# Altium schematic sheet 2_Cart_插槽板.schdoc.schdoc
size 309 x 223 mm; Symbol: Sheet-Symbol_A4; Device: Sheet-Symbol_A4; Company: 嘉立创EDA; Version: V1.0; Page Size: A4; @Project Name: 0117_230627_uMSX 4.0; @Page Count: 4; @Update Date: 2023-07-03; @Schematic Name: uMSX 4.0; @Page No: 2; @Page Name: Cart/插槽板
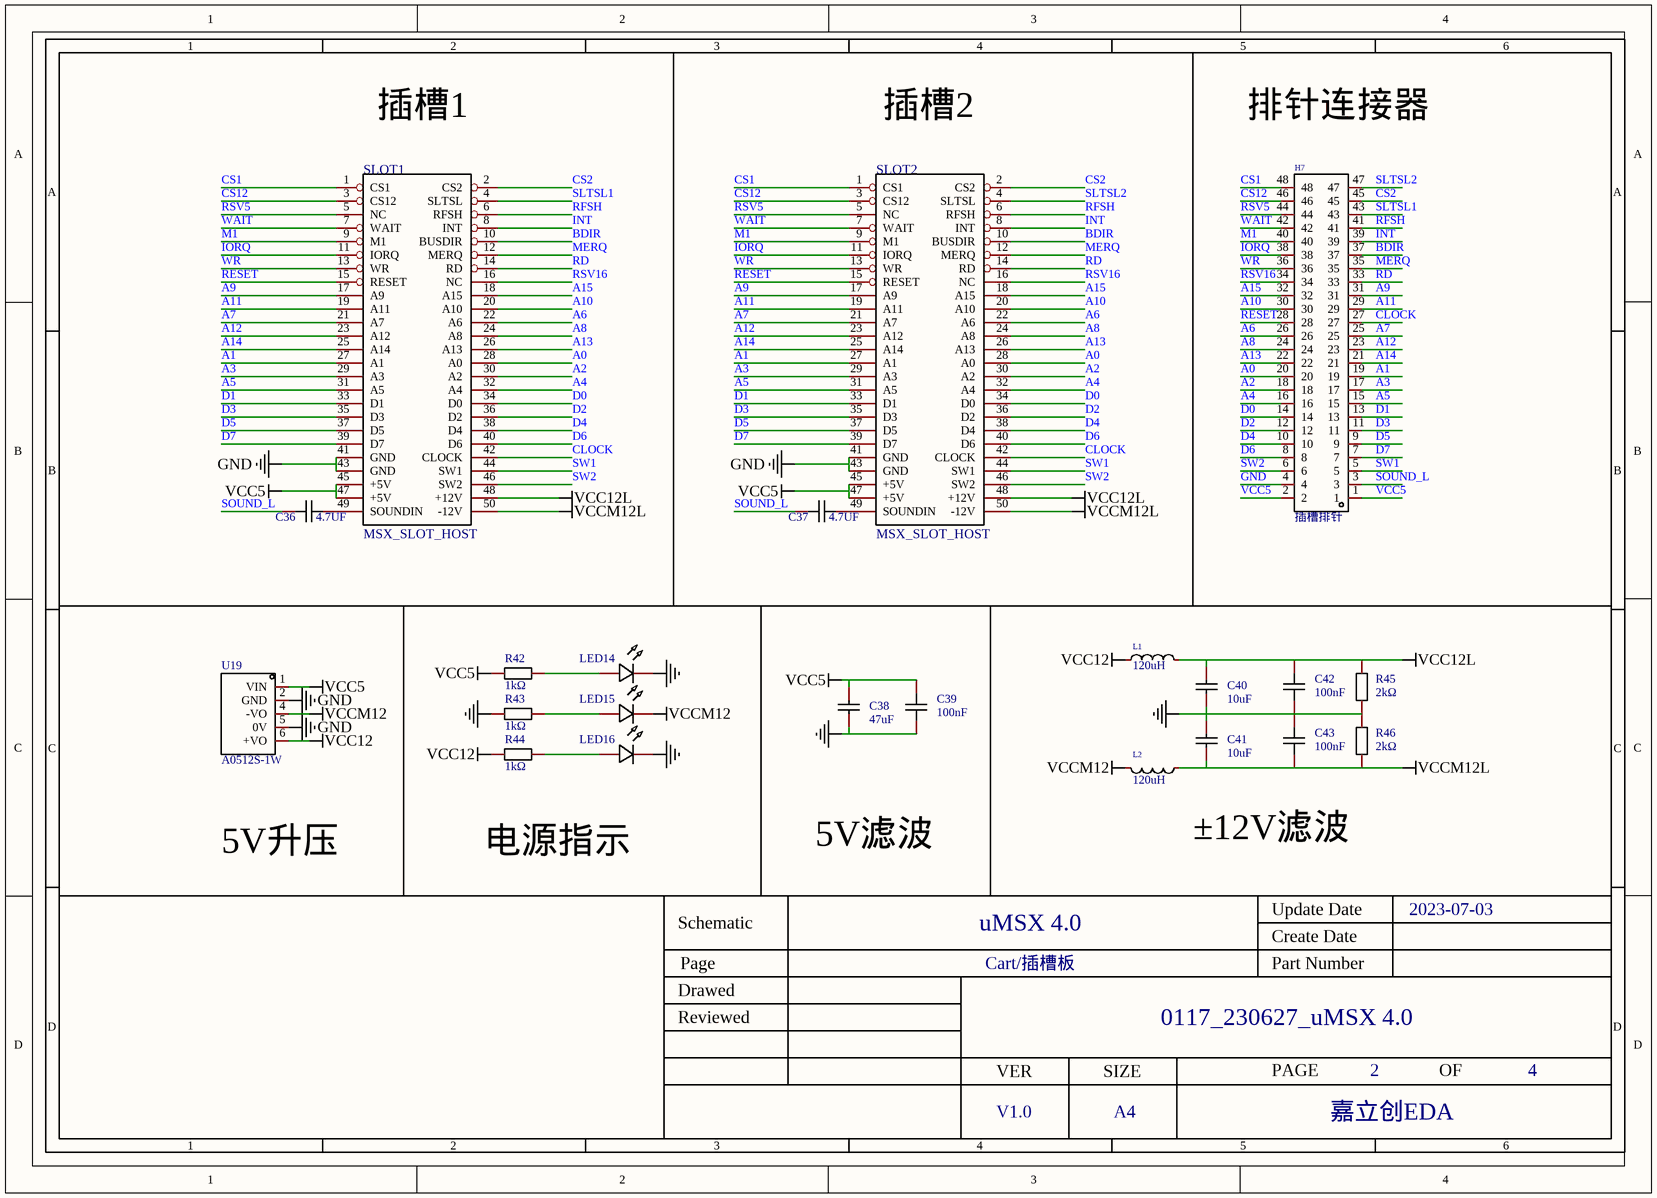
[diagram p0: 2_Cart_插槽板.schdoc.schdoc]

## Parts
C36  4.7UF  [C0603]
C37  4.7UF  [C0603]
C38  47uF  [C0805]
C39  100nF  [C0603]
C40  10uF  [C0805]
C41  10uF  [C0805]
C42  100nF  [C0603]
C43  100nF  [C0603]
H7  插槽排针  [HDR-TH_48P-P2.54-H-M-R2-C24-S2.54]
L1  120uH  [L0805]
L2  120uH  [L0805]
LED14  LED_0603-R  [LED_0603]  (value not drawn)
LED15  LED_0603-R  [LED_0603]  (value not drawn)
LED16  LED_0603-R  [LED_0603]  (value not drawn)
R42  1kΩ  [R0603]
R43  1kΩ  [R0603]
R44  1kΩ  [R0603]
R45  2kΩ  [R0603]
R46  2kΩ  [R0603]
SLOT1  MSX_SLOT_HOST  [CONN_EDGE_50P]
SLOT2  MSX_SLOT_HOST  [CONN_EDGE_50P]
U19  A0512S-1W  [PWRM-TH_7P-L19.5-W6.0-P2.54-PE3_7]

## Nets
GND: H7.4 SLOT1.41(GND) SLOT1.43(GND) SLOT2.41(GND) SLOT2.43(GND) U19.2(GND) U19.5(0V)
NetC38_1: C38.1 C39.1 C40.1 C41.2 C42.1 C43.1 LED14.1(C) LED16.1(C) R43.1 R45.1 R46.1
VCC5: C38.2 C39.2 H7.1 H7.2 R42.1 SLOT1.45(+5V) SLOT1.47(+5V) SLOT2.45(+5V) SLOT2.47(+5V) U19.1(VIN)
VCC12: L1.1 R44.1 U19.6(+VO)
VCC12L: C40.2 C42.2 L1.2 R45.2 SLOT1.48(+12V) SLOT2.48(+12V)
VCCM12: L2.1 LED15.1(C) U19.4(-VO)
VCCM12L: C41.1 C43.2 L2.2 R46.2 SLOT1.50(-12V) SLOT2.50(-12V)
A0: H7.20 SLOT1.28(A0) SLOT2.28(A0)
A1: H7.19 SLOT1.27(A1) SLOT2.27(A1)
A2: H7.18 SLOT1.30(A2) SLOT2.30(A2)
A3: H7.17 SLOT1.29(A3) SLOT2.29(A3)
A4: H7.16 SLOT1.32(A4) SLOT2.32(A4)
A5: H7.15 SLOT1.31(A5) SLOT2.31(A5)
A6: H7.26 SLOT1.22(A6) SLOT2.22(A6)
A7: H7.25 SLOT1.21(A7) SLOT2.21(A7)
A8: H7.24 SLOT1.24(A8) SLOT2.24(A8)
A9: H7.31 SLOT1.17(A9) SLOT2.17(A9)
A10: H7.30 SLOT1.20(A10) SLOT2.20(A10)
A11: H7.29 SLOT1.19(A11) SLOT2.19(A11)
A12: H7.23 SLOT1.23(A12) SLOT2.23(A12)
A13: H7.22 SLOT1.26(A13) SLOT2.26(A13)
A14: H7.21 SLOT1.25(A14) SLOT2.25(A14)
A15: H7.32 SLOT1.18(A15) SLOT2.18(A15)
BDIR: H7.37 SLOT1.10(BUSDIR) SLOT2.10(BUSDIR)
CLOCK: H7.27 SLOT1.42(CLOCK) SLOT2.42(CLOCK)
CS1: H7.48 SLOT1.1(CS1) SLOT2.1(CS1)
CS2: H7.45 SLOT1.2(CS2) SLOT2.2(CS2)
CS12: H7.46 SLOT1.3(CS12) SLOT2.3(CS12)
D0: H7.14 SLOT1.34(D0) SLOT2.34(D0)
D1: H7.13 SLOT1.33(D1) SLOT2.33(D1)
D2: H7.12 SLOT1.36(D2) SLOT2.36(D2)
D3: H7.11 SLOT1.35(D3) SLOT2.35(D3)
D4: H7.10 SLOT1.38(D4) SLOT2.38(D4)
D5: H7.9 SLOT1.37(D5) SLOT2.37(D5)
D6: H7.8 SLOT1.40(D6) SLOT2.40(D6)
D7: H7.7 SLOT1.39(D7) SLOT2.39(D7)
INT: H7.39 SLOT1.8(INT) SLOT2.8(INT)
IORQ: H7.38 SLOT1.11(IORQ) SLOT2.11(IORQ)
M1: H7.40 SLOT1.9(M1) SLOT2.9(M1)
MERQ: H7.35 SLOT1.12(MERQ) SLOT2.12(MERQ)
RD: H7.33 SLOT1.14(RD) SLOT2.14(RD)
RESET: H7.28 SLOT1.15(RESET) SLOT2.15(RESET)
RFSH: H7.41 SLOT1.6(RFSH) SLOT2.6(RFSH)
RSV5: H7.44 SLOT1.5(NC) SLOT2.5(NC)
RSV16: H7.34 SLOT1.16(NC) SLOT2.16(NC)
SLTSL1: H7.43 SLOT1.4(SLTSL)
SLTSL2: H7.47 SLOT2.4(SLTSL)
SOUND_L: C36.1 C37.1 H7.3
SW1: H7.5 SLOT1.44(SW1) SLOT2.44(SW1)
SW2: H7.6 SLOT1.46(SW2) SLOT2.46(SW2)
WAIT: H7.42 SLOT1.7(WAIT) SLOT2.7(WAIT)
WR: H7.36 SLOT1.13(WR) SLOT2.13(WR)
NetC36_2: C36.2 SLOT1.49(SOUNDIN)
NetC37_2: C37.2 SLOT2.49(SOUNDIN)
NetLED14_2: LED14.2(A) R42.2
NetLED15_2: LED15.2(A) R43.2
NetLED16_2: LED16.2(A) R44.2

## Notes on the sheet
- 插槽1
- 插槽2
- 排针连接器
- 5V升压
- 电源指示
- 5V滤波
- ±12V滤波
- 1
- 2
- 3
- 4
- 5
- 6
- A
- B
- C
- Schematic
- uMSX 4.0
- Create Date
- Update Date
- 2023-07-03
- Reviewed
- Drawed
- Page
- Cart/插槽板
- Part Number
- 0117_230627_uMSX 4.0
- D
- VER
- SIZE
- PAGE
- OF
- V1.0
- A4
- 嘉立创EDA

## Library data of the parts
C36 C37 C39 C42 C43 = CAP_0603: Symbol: CapAcitance; Convert to PCB: yes; Device: CAP_0603; Add into BOM: yes; Supplier Footprint: 0603
  C36 C37: Name: 4.7UF; Value: 4.7UF
  C39 C42 C43: Name: 100nF; Value: 100nF
C38 C40 C41 = CL21A476MQYNNNE: Manufacturer: SAMSUNG(三星); Add into BOM: yes; Tolerance: ±20%; Voltage Rated: 6.3V; Temperature Coefficient: X5R; Description: 容值:47uF;精度:±20%;额定电压:6.3V;材质(温度系数):X5R;; Symbol: CL21A476MQYNNNE; Device: CL21A476MQYNNNE; LCSC Part Name: 47uF ±20% 6.3V; Supplier Part: C16780; Manufacturer Part: CL21A476MQYNNNE; Supplier Footprint: 0805; JLCPCB Part Class: Basic Part; Datasheet: https://atta.szlcsc.com/upload/public/pdf/source/20160103/1457707690276.pdf; Supplier: LCSC; Convert to PCB: yes
  C38: Name: 47uF; Value: 47uF
  C40 C41: Name: 10uF; Value: 10uF
H7 = X6521WR-2x24H-C30D60: Manufacturer: XKB Connectivity(中国星坤); Symbol: X6521WR-2×24H-C30D60; Add into BOM: yes; Pitch: 2.54mm; Pin Structure: 2x24P; Circluar Pins/Square Pins: 方针; Current Rating (Max): 3A; Voltage Rating (Max): 250V; Welding Temperature (Max): 260℃; Description: 排数:双排;总PIN位数:48P;间距:2.54mm;插针结构:2x24P;行距:2.54mm;安装类型:弯插;圆针/方针:方针;额定电流:3A;额定电压:250V;配合针长度:6mm;塑高:2.5mm;端接针长度:-;触头材质:黄铜;触头镀层:金;工作温度范围:-40℃~+105℃;焊接温度(最大值):260℃;颜色:黑色;; Name: 插槽排针; Device: X6521WR-2x24H-C30D60; Supplier: LCSC; Supplier Part: C725936; Manufacturer Part: 插槽排针; JLCPCB Part Class: Extended Part; LCSC Part Name: 2.54mm 2x24P 弯插 方针 高镀金 抗氧化; Supplier Footprint: 弯插,P=2.54mm; Datasheet: https://atta.szlcsc.com/upload/public/pdf/source/20211009/B321D35F509179B46434BAB3052FF950.pdf; Convert to PCB: yes; Number of Rows: 双排; Number of Pins: 48P; Row Spacing: 2.54mm; Mounting Type: 弯插; Length of Mating Pin: 6mm; Insulation Height: 2.5mm; Length of End Connection Pin: -; Contact Material: 黄铜; Contact Plating: 金; Operating Temperature Range: -40℃~+105℃; Color: 黑色
L1 L2 = A-6-9007-2: Manufacturer: 增益; Add into BOM: yes; Tolerance: ±25%; Rated Current: 5A; DC Resistance (DCR): 10mΩ; Description: 电感值:120uH;精度:±25%;额定电流:5A;饱和电流(Isat):-;直流电阻(DCR):10mΩ;; Name: 120uH; Symbol: A-6-9007-2; Device: A-6-9007-2; Supplier: LCSC; Supplier Part: C2943443; Manufacturer Part: A-6-9007-2; Inductance: -; JLCPCB Part Class: Extended Part; LCSC Part Name: 120uH ±25%; Supplier Footprint: 0805; Datasheet: https://atta.szlcsc.com/upload/public/pdf/source/20221214/4439AAE6604FA602CB936A59554380E0.pdf; Convert to PCB: yes; Value: 120uH; Saturation Current (Isat): -; Q @ Freq: -; Frequency - Self Resonant: -; Ratings: -
LED14-LED16 = LED_0603-R: Symbol: LED_R; Convert to PCB: yes; Device: LED_0603-R; Add into BOM: yes; Supplier Footprint: 0603
R42-R44 = 0603WAF1001T5E: Manufacturer: UNI-ROYAL(厚声); Add into BOM: yes; Tolerance: ±1%; Power(Watts): 100mW; Temperature Coefficient: ±100ppm/℃; Overload Voltage (Max): 75V; Description: 电阻类型:厚膜电阻;阻值:1kΩ;精度:±1%;功率:100mW;; Name: 1kΩ; Symbol: 0603WAF1001T5E; Device: 0603WAF1001T5E; LCSC Part Name: 1kΩ ±1% 100mW; Supplier Part: C21190; Manufacturer Part: 0603WAF1001T5E; Supplier Footprint: 0603; JLCPCB Part Class: Basic Part; Datasheet: https://atta.szlcsc.com/upload/public/pdf/source/20200306/C422600_1E6D84923E4A46A82E41ADD87F860B5C.pdf; Supplier: LCSC; Convert to PCB: yes; Type: 厚膜电阻; Value: 1kΩ; Operating Temperature Range: -55℃~+155℃
R45 R46 = 0603WAF2001T5E: Manufacturer: UNI-ROYAL(厚声); Add into BOM: yes; Tolerance: ±1%; Power(Watts): 100mW; Temperature Coefficient: ±100ppm/℃; Overload Voltage (Max): 75V; Description: 电阻类型:厚膜电阻;阻值:2kΩ;精度:±1%;功率:100mW;; Name: 2kΩ; Symbol: 0603WAF2001T5E; Device: 0603WAF2001T5E; LCSC Part Name: 2kΩ ±1% 100mW; Supplier Part: C22975; Manufacturer Part: 0603WAF2001T5E; Supplier Footprint: 0603; JLCPCB Part Class: Basic Part; Datasheet: https://atta.szlcsc.com/upload/public/pdf/source/20200306/C422600_1E6D84923E4A46A82E41ADD87F860B5C.pdf; Supplier: LCSC; Convert to PCB: yes; Type: 厚膜电阻; Value: 2kΩ; Operating Temperature Range: -55℃~+155℃
SLOT1 SLOT2 = MSX_SLOT_HOST: Add into BOM: yes; Name: MSX_SLOT_HOST; Symbol: MSX_SLOT_HOST; Device: MSX_SLOT_HOST; value: MSX_SLOT_HOST; Convert to PCB: yes; Origin Footprint: CONN_EDGE_50P
U19 = A0512S-1W: Manufacturer: HENIPER(恒浦); Add into BOM: yes; Name: A0512S-1W; Symbol: A0512S-1W; Device: A0512S-1W; LCSC Part Name: A0512S-1W; Supplier Part: C234081; Manufacturer Part: A0512S-1W; Supplier Footprint: 插件; JLCPCB Part Class: Extended Part; Datasheet: https://atta.szlcsc.com/upload/public/pdf/source/20180712/C234081_BEEA7F0845E4F50560A4C5E91B2727AE.pdf; Supplier: LCSC; Convert to PCB: yes; Description: -